# Altium schematic sheet Analog_HC_Overcurrent_Redundancy.SchDoc
size A
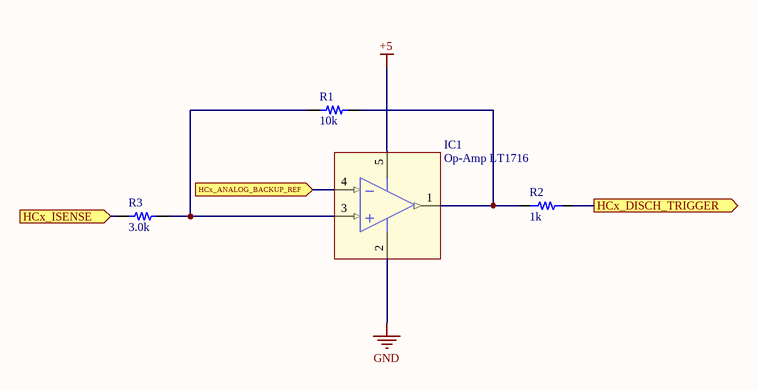
[diagram p0: Analog_HC_Overcurrent_Redundancy.SchDoc]

## Parts
IC1  Op-Amp LT1716  [SOT23-5]
R1  value 10k  [RES 0603/1608]  (hidden comment: Resistor 10k 0603 1/10W 1%)
R2  value 1k  [RES 0805/2012]  (hidden comment: Resistor 1k 0805 1/10W 1%)
R3  value 3.0k  [RES 0603/1608]  (hidden comment: Resistor 3.0k 0603 1/10W 1%)

## Ports
HCx_ANALOG_BACKUP_REF (in), HCx_DISCH_TRIGGER (out), HCx_ISENSE (in)

## Nets
+5: IC1.5(V+)
GND: IC1.2(V-)
HCx_ANALOG_BACKUP_REF: IC1.4(IN-) ; port HCx_ANALOG_BACKUP_REF
HCx_DISCH_TRIGGER: R2.2 ; port HCx_DISCH_TRIGGER
HCx_ISENSE: R3.1 ; port HCx_ISENSE
NetIC1_1: IC1.1(OUT) R1.2 R2.1
NetIC1_3: IC1.3(IN+) R1.1 R3.2

## Library data of the parts
IC1 = 4: Manufacturer_id: 1; MfrPartNo: LT1716IS5#PBF; idOp_Amp: 4; Drawer_id: 1; Name: Op-Amp LT1716; Num_Circuits: 1
R1 = 313: Manufacturer_id: 1; idResistor: 313; Name: Res_10k_0603_1/10W_1%; Created_By: Nick Mah; Supplier 1: Digi-Key; Drawer_id: 1; Tolerance: 1%; Power: 1/10W; Package: 0603; ComponentLink1Description: Datasheet; Created_Date: 2018-10-20
R2 = 529: Manufacturer_id: 1; idResistor: 529; Name: Res_10k_0805_1/10W_1%; Created_By: Nick Mah; Supplier 1: Digi-Key; Drawer_id: 1; Tolerance: 1%; Power: 1/10W; Package: 0805; ComponentLink1Description: Datasheet; Created_Date: 2018-10-20
R3 = 300: Manufacturer_id: 1; idResistor: 300; Name: Res_3.0k_0603_1/10W_1%; Created_By: Nick Mah; Supplier 1: Digi-Key; Drawer_id: 1; Tolerance: 1%; Power: 1/10W; Package: 0603; ComponentLink1Description: Datasheet; Created_Date: 2018-10-20